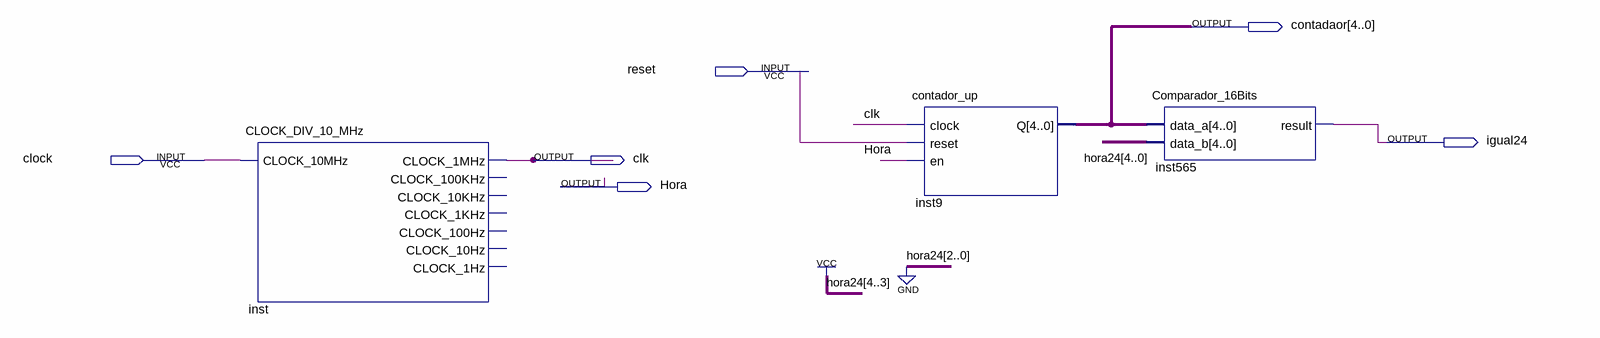
[diagram p0: schematic sheet]
// Quartus schematic Block3.bdf as structural Verilog: 3 symbols, 6 pins
module Block3 (
  input  reset,
  input  clock,
  output [4:0] contadaor,
  output igual24,
  output clk,
  output Hora
);

  CLOCK_DIV_10_MHz inst (
    .CLOCK_10MHz(clock), .CLOCK_1MHz(clk));  // open: CLOCK_100KHz, CLOCK_10KHz, CLOCK_1KHz, CLOCK_100Hz, CLOCK_10Hz, CLOCK_1Hz
  contador_up inst9 (.clock(clk), .reset(reset), .en(Hora), .Q(contadaor));
  Comparador_16Bits inst565 (.data_a(contadaor), .data_b(5'b11000), .result(igual24));
endmodule
